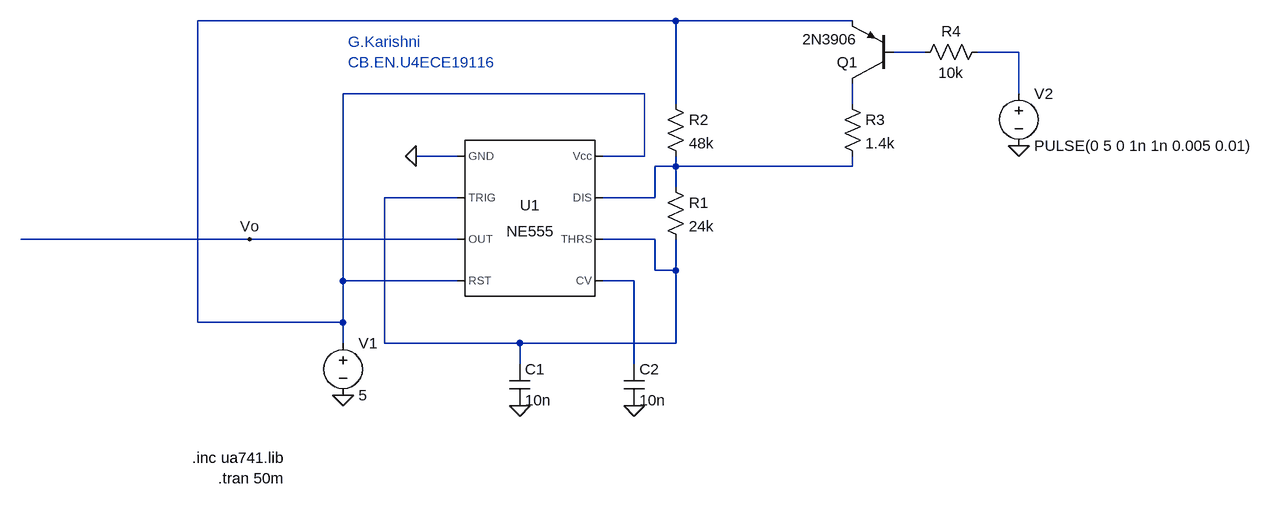
[diagram p0: schematic Draft2.asc]
Draft2.asc, the LTspice schematic file:
Version 4
SHEET 1 1400 1060
WIRE 448 -128 -288 -128
WIRE 720 -128 448 -128
WIRE 832 -80 784 -80
WIRE 976 -80 912 -80
WIRE 400 -16 -64 -16
WIRE 976 -16 976 -80
WIRE 448 0 448 -128
WIRE 720 0 720 -32
WIRE 112 80 48 80
WIRE 400 80 400 -16
WIRE 400 80 336 80
WIRE 448 96 448 80
WIRE 448 96 416 96
WIRE 720 96 720 80
WIRE 720 96 448 96
WIRE 448 128 448 96
WIRE 112 144 0 144
WIRE 416 144 416 96
WIRE 416 144 336 144
WIRE -208 208 -560 208
WIRE 112 208 -208 208
WIRE 416 208 336 208
WIRE 416 256 416 208
WIRE 448 256 448 208
WIRE 448 256 416 256
WIRE -64 272 -64 -16
WIRE 112 272 -64 272
WIRE 384 272 336 272
WIRE -288 336 -288 -128
WIRE -64 336 -64 272
WIRE -64 336 -288 336
WIRE -64 368 -64 336
WIRE 0 368 0 144
WIRE 208 368 0 368
WIRE 448 368 448 256
WIRE 448 368 208 368
WIRE 208 400 208 368
WIRE 384 400 384 272
FLAG -64 448 0
FLAG 48 80 0
FLAG -208 208 Vo
FLAG 976 64 0
FLAG 208 464 0
FLAG 384 464 0
SYMBOL Misc\\NE555 224 176 R0
SYMATTR InstName U1
SYMBOL cap 192 400 R0
SYMATTR InstName C1
SYMATTR Value 10n
SYMBOL res 432 112 R0
SYMATTR InstName R1
SYMATTR Value 24k
SYMBOL res 432 -16 R0
SYMATTR InstName R2
SYMATTR Value 48k
SYMBOL cap 368 400 R0
SYMATTR InstName C2
SYMATTR Value 10n
SYMBOL voltage -64 352 R0
WINDOW 123 0 0 Left 0
WINDOW 39 0 0 Left 0
SYMATTR InstName V1
SYMATTR Value 5
SYMBOL pnp 784 -32 R180
SYMATTR InstName Q1
SYMATTR Value 2N3906
SYMBOL res 704 -16 R0
SYMATTR InstName R3
SYMATTR Value 1.4k
SYMBOL res 928 -96 R90
WINDOW 0 0 56 VBottom 2
WINDOW 3 32 56 VTop 2
SYMATTR InstName R4
SYMATTR Value 10k
SYMBOL voltage 976 -32 R0
WINDOW 123 0 0 Left 0
WINDOW 39 0 0 Left 0
SYMATTR InstName V2
SYMATTR Value PULSE(0 5 0 1n 1n 0.005 0.01)
TEXT -56 -96 Left 2 ;G.Karishni
TEXT -56 -64 Left 2 ;CB.EN.U4ECE19116
TEXT -256 576 Left 2 !.tran 50m
TEXT -296 544 Left 2 !.inc ua741.lib

The netlist it stands for:
* Draft2.asc
XU1 0 N006 Vo N001 N007 N006 N005 N001 NE555  ; pins GND TRIG OUT RST CV THRS DIS Vcc
C1 N006 0 10n
R1 N005 N006 24k
R2 N001 N005 48k
C2 N007 0 10n
V1 N001 0 5
Q1 N004 N002 N001 0 2N3906
R3 N004 N005 1.4k
R4 N003 N002 10k
V2 N003 0 PULSE(0 5 0 1n 1n 0.005 0.01)
.model NPN NPN
.model PNP PNP
.lib standard.bjt
* G.Karishni
* CB.EN.U4ECE19116
.tran 50m
.inc ua741.lib
.lib NE555.sub
.backanno
.end